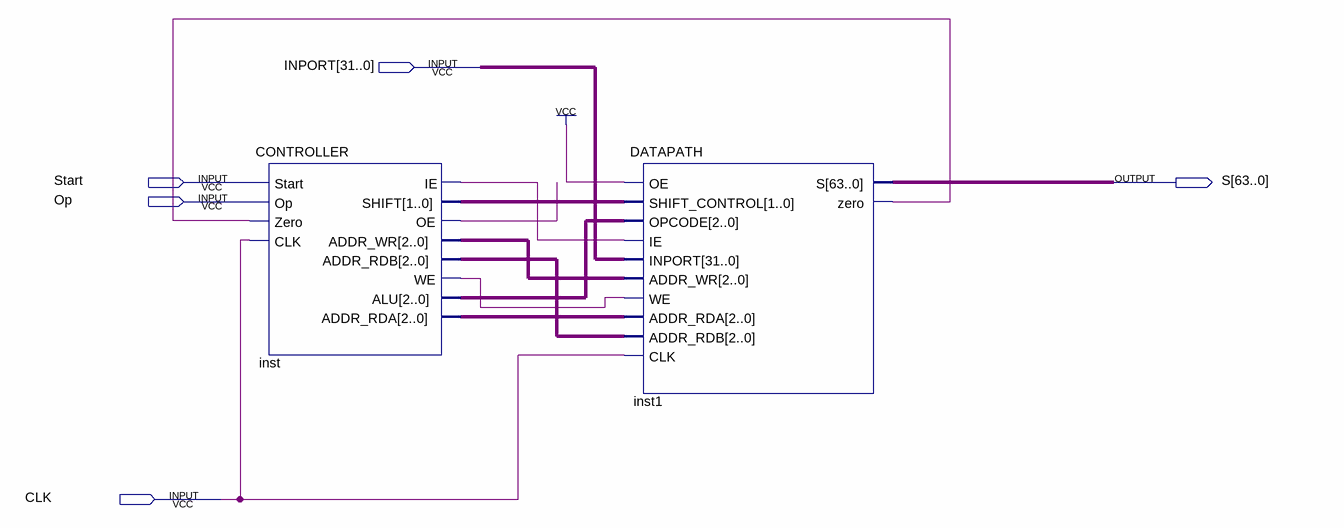
[diagram p0: schematic sheet]
// Quartus schematic DoAnCK.bdf as structural Verilog: 2 symbols, 5 pins
module DoAnCK (
  input  [31:0] INPORT,
  input  Start,
  input  Op,
  input  CLK,
  output [63:0] S
);

  wire inst1_zero, inst_ie, inst_oe, inst_we;
  wire [1:0] inst_shift;
  wire [2:0] inst_addr_rda, inst_addr_rdb, inst_addr_wr, inst_alu;

  CONTROLLER inst (
    .Start(Start), .Op(Op), .Zero(inst1_zero), .CLK(CLK), .IE(inst_ie), .SHIFT(inst_shift), .OE(inst_oe),
    .ADDR_WR(inst_addr_wr), .ADDR_RDB(inst_addr_rdb), .WE(inst_we), .ALU(inst_alu), .ADDR_RDA(inst_addr_rda));
  DATAPATH inst1 (
    .OE(1'b1), .SHIFT_CONTROL(inst_shift), .OPCODE(inst_alu), .IE(inst_ie), .INPORT(INPORT),
    .ADDR_WR(inst_addr_wr), .WE(inst_we), .ADDR_RDA(inst_addr_rda), .ADDR_RDB(inst_addr_rdb), .CLK(CLK),
    .S(S), .zero(inst1_zero));
endmodule
